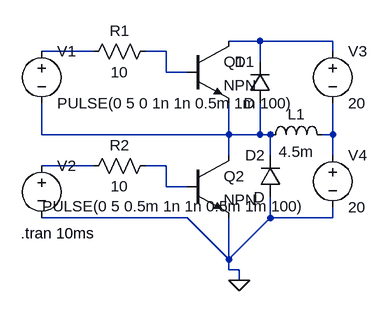
[diagram p0: schematic inverter_L.asc]
inverter_L.asc, the LTspice schematic file:
Version 4
SHEET 1 880 680
WIRE 240 48 192 48
WIRE 352 48 240 48
WIRE -16 64 -96 64
WIRE 96 64 64 64
WIRE 352 64 352 48
WIRE 240 80 240 48
WIRE 96 96 96 64
WIRE 128 96 96 96
WIRE -96 192 -96 144
WIRE 192 192 192 144
WIRE 192 192 -96 192
WIRE 240 192 240 144
WIRE 240 192 192 192
WIRE 256 192 240 192
WIRE 352 192 352 144
WIRE 352 192 336 192
WIRE 192 224 192 192
WIRE 256 224 256 192
WIRE 352 224 352 192
WIRE -16 240 -96 240
WIRE 96 240 64 240
WIRE 96 272 96 240
WIRE 128 272 96 272
WIRE 128 320 -96 320
WIRE 256 320 256 288
WIRE 352 320 352 304
WIRE 352 320 256 320
WIRE 192 384 128 320
WIRE 192 384 192 320
WIRE 192 384 256 320
WIRE 192 400 192 384
WIRE 208 400 192 400
WIRE 208 416 208 400
FLAG 208 416 0
SYMBOL res 80 48 R90
WINDOW 0 0 56 VBottom 2
WINDOW 3 32 56 VTop 2
SYMATTR InstName R1
SYMATTR Value 10
SYMBOL res 80 224 R90
WINDOW 0 0 56 VBottom 2
WINDOW 3 32 56 VTop 2
SYMATTR InstName R2
SYMATTR Value 10
SYMBOL voltage -96 48 R0
WINDOW 123 0 0 Left 0
WINDOW 39 0 0 Left 0
SYMATTR InstName V1
SYMATTR Value PULSE(0 5 0 1n 1n 0.5m 1m 100)
SYMBOL voltage -96 224 R0
WINDOW 123 0 0 Left 0
WINDOW 39 0 0 Left 0
WINDOW 3 1 78 Left 2
SYMATTR Value PULSE(0 5 0.5m 1n 1n 0.5m 1m 100)
SYMATTR InstName V2
SYMBOL voltage 352 48 R0
WINDOW 123 0 0 Left 0
WINDOW 39 0 0 Left 0
SYMATTR InstName V3
SYMATTR Value 20
SYMBOL voltage 352 208 R0
WINDOW 123 0 0 Left 0
WINDOW 39 0 0 Left 0
SYMATTR InstName V4
SYMATTR Value 20
SYMBOL npn 128 48 R0
SYMATTR InstName Q1
SYMBOL npn 128 224 R0
SYMATTR InstName Q2
SYMBOL diode 256 144 R180
WINDOW 0 24 64 Left 2
WINDOW 3 24 0 Left 2
SYMATTR InstName D1
SYMBOL diode 272 288 R180
WINDOW 0 24 64 Left 2
WINDOW 3 24 0 Left 2
SYMATTR InstName D2
SYMBOL ind 240 208 R270
WINDOW 0 32 56 VTop 2
WINDOW 3 5 56 VBottom 2
SYMATTR InstName L1
SYMATTR Value 4.5m
TEXT -128 344 Left 2 !.tran 10ms

The netlist it stands for:
* inverter_L.asc
R1 N003 N002 10
R2 N007 N006 10
V1 N002 N004 PULSE(0 5 0 1n 1n 0.5m 1m 100)
V2 N006 0 PULSE(0 5 0.5m 1n 1n 0.5m 1m 100)
V3 N001 N005 20
V4 N005 0 20
Q1 N001 N003 N004 0 NPN
Q2 N004 N007 0 0 NPN
D1 N004 N001 D
D2 0 N004 D
L1 N004 N005 4.5m
.model D D
.lib standard.dio
.model NPN NPN
.model PNP PNP
.lib standard.bjt
.tran 10ms
.backanno
.end